# EasyEDA schematic SCH_ThePoweredProject_2023-10-22.json
TITLE: OpenPower; REV: 1.0; Date: 18-08-2023; Sheet: 1/1; Drawn By: Shaurya
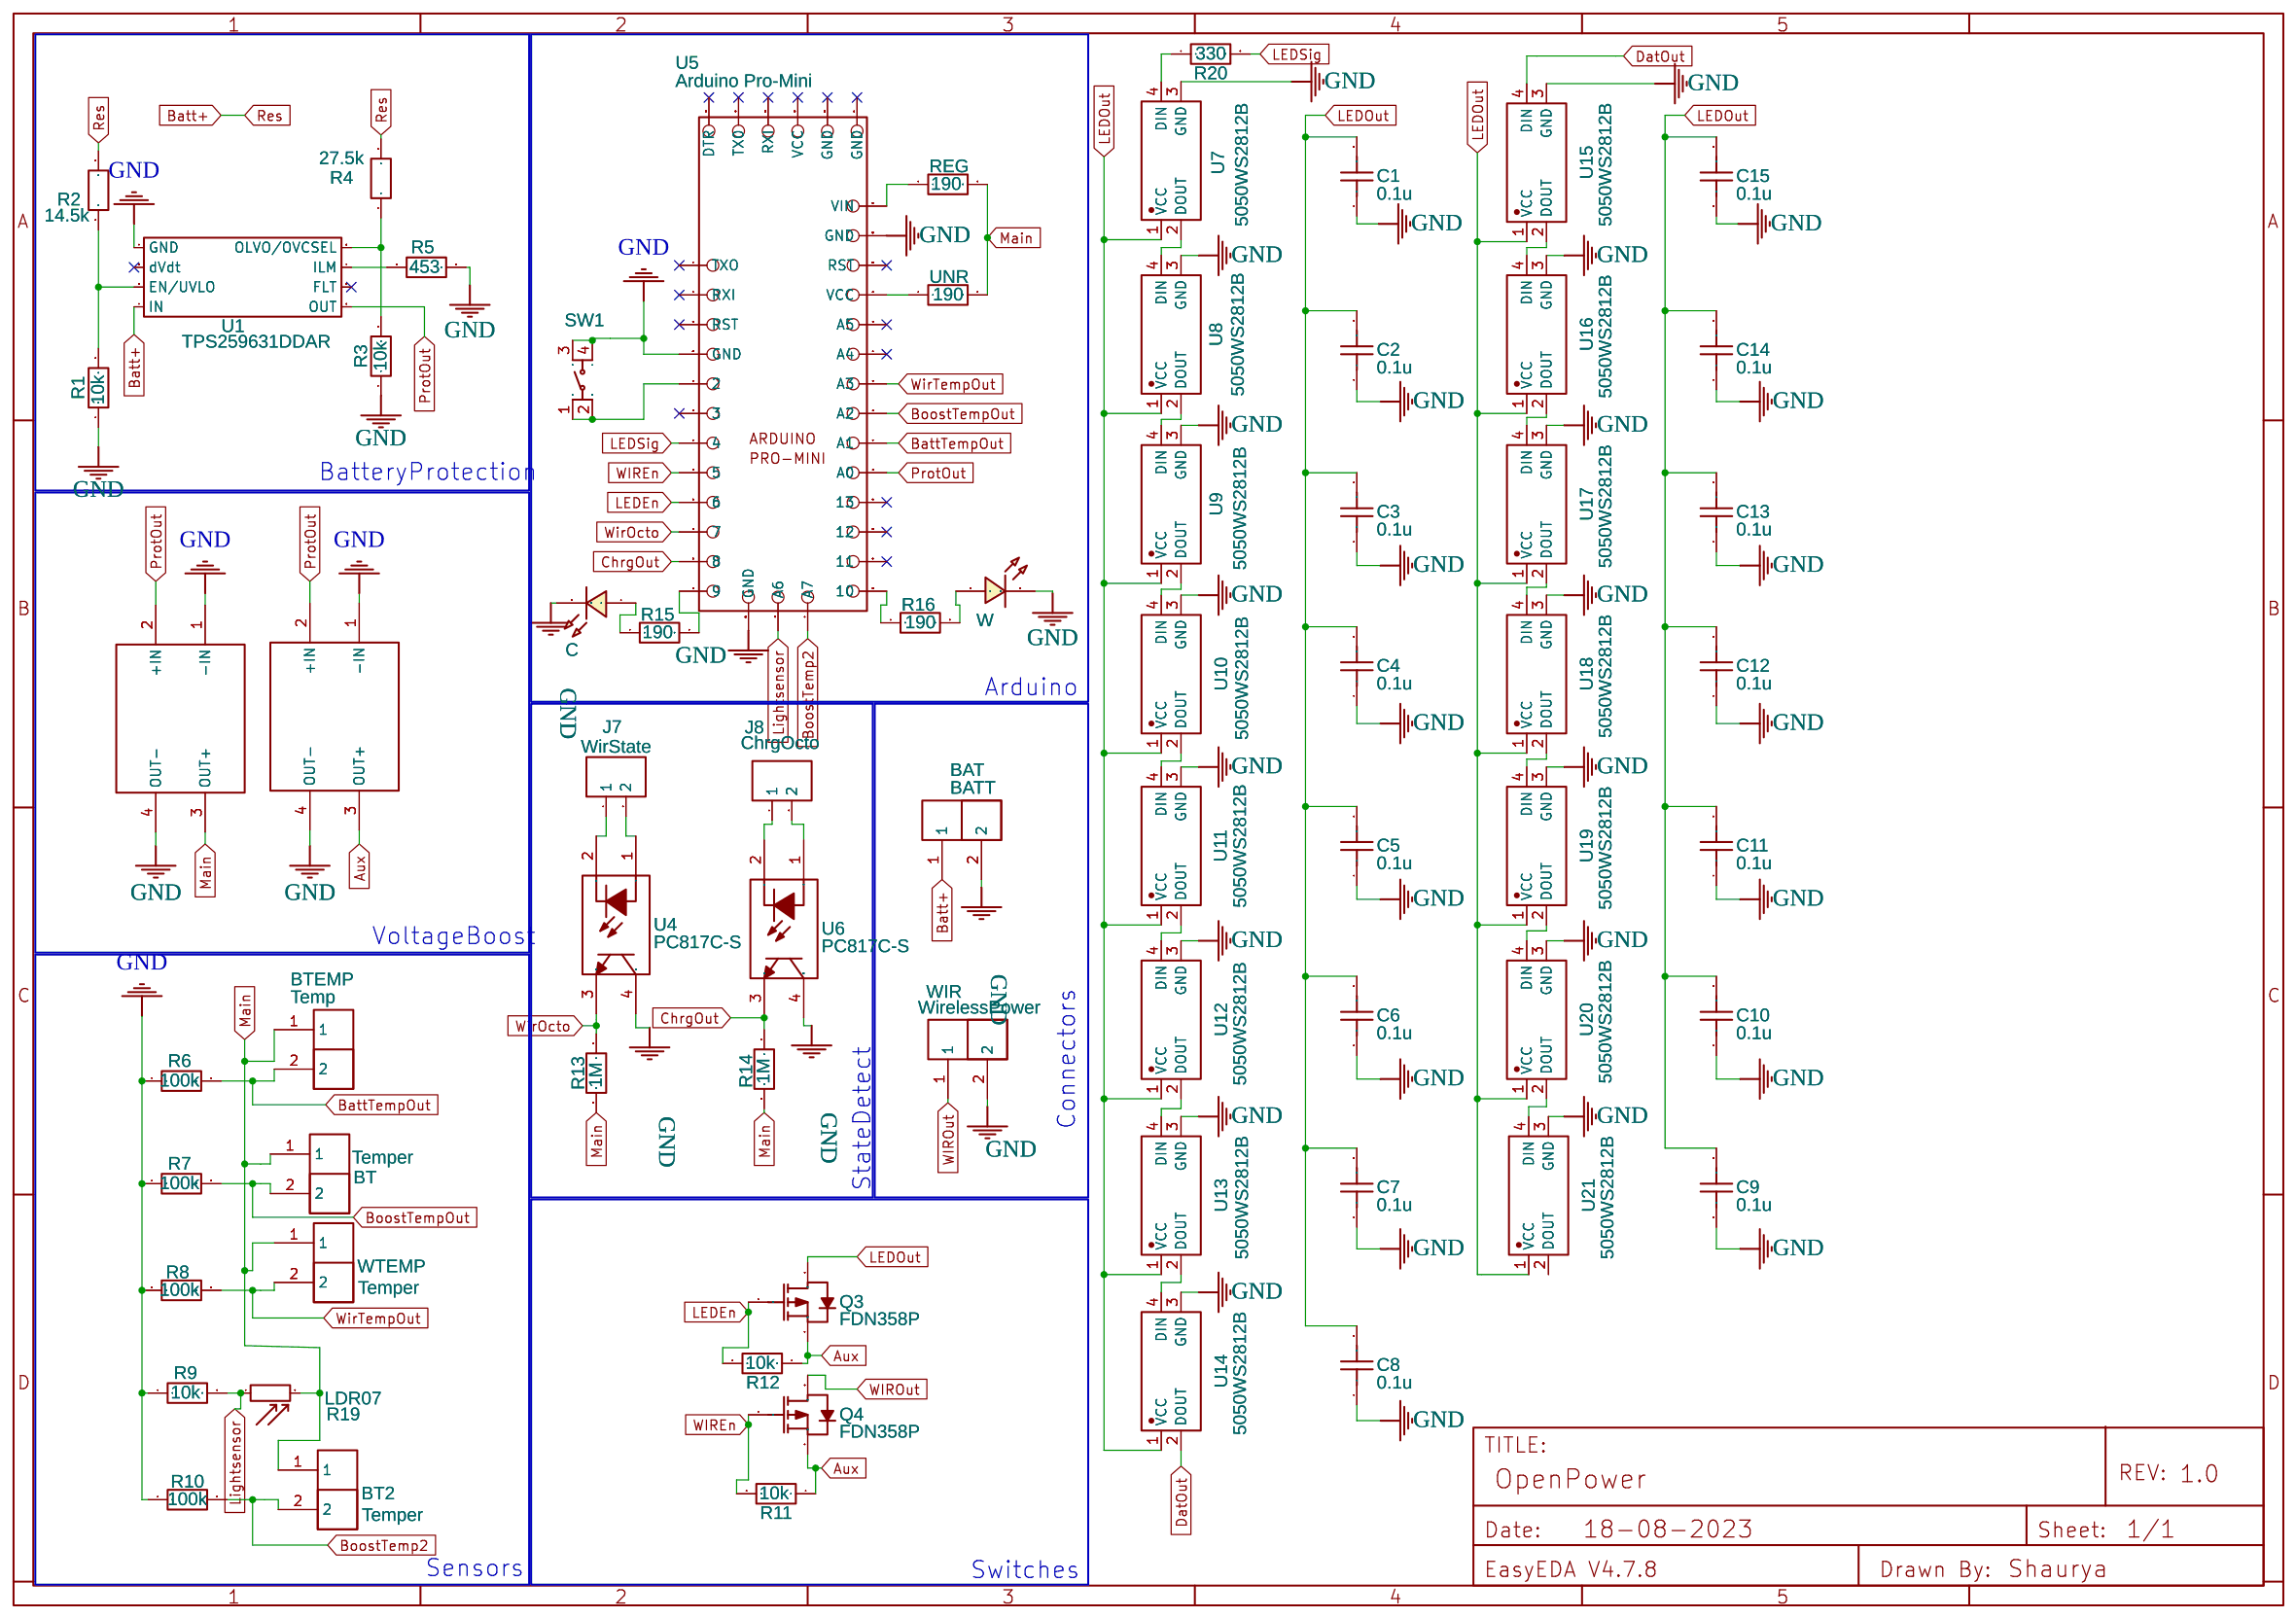
[diagram p0: schematic sheet]

## Parts
BAT  BATT  [SMD_PADS]
BT  Temper  [SMD_PADS]
BT2  Temper  [SMD_PADS]
BTEMP  Temp  [SMD_PADS]
C  LED2  [LED0603_RED]
C1  0.1u  [C0603]
C2  0.1u  [C0603]
C3  0.1u  [C0603]
C4  0.1u  [C0603]
C5  0.1u  [C0603]
C6  0.1u  [C0603]
C7  0.1u  [C0603]
C8  0.1u  [C0603]
C9  0.1u  [C0603]
C10  0.1u  [C0603]
C11  0.1u  [C0603]
C12  0.1u  [C0603]
C13  0.1u  [C0603]
C14  0.1u  [C0603]
C15  0.1u  [C0603]
J7  WirState  [HDR-M-2.54_1X2]
J8  ChrgOcto  [HDR-M-2.54_1X2]
Q3  FDN358P  [SOT-23-3_L2.9-W1.6-P1.90-LS2.8-BR]
Q4  FDN358P  [SOT-23-3_L2.9-W1.6-P1.90-LS2.8-BR]
R1  10k  [R0603]
R2  14.5k  [R0603]
R3  10k  [R0603]
R4  27.5k  [R0603]
R5  453  [R0603]
R6  100k  [R0603]
R7  100k  [R0603]
R8  100k  [R0603]
R9  10k  [R0603]
R10  100k  [R0603]
R11  10k  [R0603]
R12  10k  [R0603]
R13  1M  [R0603]
R14  1M  [R0603]
R15  190  [R0603]
R16  190  [R0603]
R19  LDR07  [RESISTOR_LDR_5.1X4.3_RM3.4]
R20  330  [R0603]
REG  190  [R0603]
SW1  Black SMD switch  [PTS647]
U1  TPS259631DDAR  [TPS259631DDAR]
U2  Mini boost DC-DC converter  [MINI BOOST DC-ВС CONVERTER]
U3  Mini boost DC-DC converter  [MINI BOOST DC-ВС CONVERTER]
U4  PC817C-S  [SOP-4_L6.5-W4.6-P2.54-LS10.3-TL]
U5  Arduino Pro-Mini  [ARDUINOPROMINI_ARDUINO_PRO_MINI]
U6  PC817C-S  [SOP-4_L6.5-W4.6-P2.54-LS10.3-TL]
U7  5050WS2812B  [LED-SMD_5050WS2812B]
U8  5050WS2812B  [LED-SMD_5050WS2812B]
U9  5050WS2812B  [LED-SMD_5050WS2812B]
U10  5050WS2812B  [LED-SMD_5050WS2812B]
U11  5050WS2812B  [LED-SMD_5050WS2812B]
U12  5050WS2812B  [LED-SMD_5050WS2812B]
U13  5050WS2812B  [LED-SMD_5050WS2812B]
U14  5050WS2812B  [LED-SMD_5050WS2812B]
U15  5050WS2812B  [LED-SMD_5050WS2812B]
U16  5050WS2812B  [LED-SMD_5050WS2812B]
U17  5050WS2812B  [LED-SMD_5050WS2812B]
U18  5050WS2812B  [LED-SMD_5050WS2812B]
U19  5050WS2812B  [LED-SMD_5050WS2812B]
U20  5050WS2812B  [LED-SMD_5050WS2812B]
U21  5050WS2812B  [LED-SMD_5050WS2812B]
UNR  190  [R0603]
W  Led1  [LED0603_RED]
WIR  WirelessPower  [SMD_PADS]
WTEMP  Temper  [SMD_PADS]

## Library data of the parts
BAT BT BT2 BTEMP WIR WTEMP = 2 smd pads: Contributor: Shaurya
C W = LED-0603_R: Manufacturer: EVERLIGHT(台湾亿光); Manufacturer Part: 19-217/R6C-AL1M2VY/3T; Supplier Part: C72044; Supplier: LCSC; Contributor: LCEDA_01
C1-C15 = C_0603_US: Contributor: LCEDA_Lib
J7 J8 = HDR-M-2.54_1x2: Supplier Part: C124375; Supplier: LCSC; Contributor: LCEDA_Lib
Q3 Q4 = FDN358P: Supplier: LCSC; Manufacturer: onsemi(安森美); Supplier Part: C24848; JLCPCB Part Class: Extended Part
R1-R16 R20 REG UNR = R_0603_EU: Contributor: LCEDA_Lib
R19 = LDR07: Contributor: KiCAD; license: https://www.gnu.org/licenses/lgpl-2.1.html
SW1 = Black SMD switch: Supplier: Digi-Key; Supplier Part: CKN9084CT-ND; Manufacturer: C&K; Manufacturer Part: PTS 647 SM50 SMTR2 LFS; Contributor: dr.Sybren
U1 = TPS259631DDAR: Contributor: MarvinVoetmann
U2 U3 = Mini boost DC-DC converter: Contributor: fancarver
U4 U6 = PC817C-S: Supplier: LCSC; Supplier Part: C3008369; Manufacturer: UMW(广东友台半导体); link: https://atta.szlcsc.com/upload/public/pdf/source/20220426/D9D4F16FD03F9B6A371B29B6E9F939A1.pdf; Contributor: lcsc; JLCPCB Part Class: Extended Part
U5 = Arduino Pro-Mini: Contributor: Yaroslav Jar
U7-U21 = 5050WS2812B: Contributor: LCSC; Supplier: LCSC; Supplier Part: C2874876; Manufacturer: null; JLCPCB Part Class: Extended Part; link: https://lcsc.com/eda_search?q=C2874876&%26type=1&ref=editor

## Nets
GND: BAT.2 C.2 C1.1 C2.1 C3.1 C4.1 C5.1 C6.1 C7.1 C8.1 C9.1 C10.1 C11.1 C12.1 C13.1 C14.1 C15.1 R1.1 R3.1 R5.1 R6.1 R7.1 R8.1 R9.1 R10.1 SW1.3 SW1.4 U1.1(GND) U2.1(-IN) U2.4(OUT-) U3.1(-IN) U3.4(OUT-) U4.4(COL) U5.GND U5.GND@1(GND) U5.GND@3(GND) U6.4(COL) U7.3(GND) U8.3(GND) U9.3(GND) U10.3(GND) U11.3(GND) U12.3(GND) U13.3(GND) U14.3(GND) U15.3(GND) U16.3(GND) U17.3(GND) U18.3(GND) U19.3(GND) U20.3(GND) U21.3(GND) W.2 WIR.2
Aux: Q3.2(S) Q4.2(S) R11.1 R12.1 U3.3(OUT+)
Batt+: BAT.1 R2.2 R4.2 U1.4(IN)
BattTempOut: BTEMP.2 R6.2 U5.A1
BoostTemp2: BT2.2 R10.2 U5.A7
BoostTempOut: BT.2 R7.2 U5.A2
ChrgOut: R14.1 U5.D8(8) U6.3(EM)
DatOut: U14.2(DOUT) U15.4(DIN)
LEDEn: Q3.1(G) R12.2 U5.D6(6)
LEDOut: C1.2 C2.2 C3.2 C4.2 C5.2 C6.2 C7.2 C8.2 C9.2 C10.2 C11.2 C12.2 C13.2 C14.2 C15.2 Q3.3(D) U7.1(VCC) U8.1(VCC) U9.1(VCC) U10.1(VCC) U11.1(VCC) U12.1(VCC) U13.1(VCC) U14.1(VCC) U15.1(VCC) U16.1(VCC) U17.1(VCC) U18.1(VCC) U19.1(VCC) U20.1(VCC) U21.1(VCC)
LEDSig: R20.2 U5.D4(4)
Lightsensor: R9.2 R19.1 U5.A6
Main: BT.1 BT2.1 BTEMP.1 R13.2 R14.2 R19.2 REG.2 U2.3(OUT+) UNR.2 WTEMP.1
ProtOut: U1.5(OUT) U2.2(+IN) U3.2(+IN) U5.A0
WIREn: Q4.1(G) R11.2 U5.D5(5)
WirOcto: R13.1 U4.3(EM) U5.D7(7)
WIROut: Q4.3(D) WIR.1
WirTempOut: R8.2 U5.A3 WTEMP.2
Net-(C-1): C.1 R15.1
Net-(J7-1): J7.1 U4.2(CAT)
Net-(J7-2): J7.2 U4.1(AN)
Net-(J8-1): J8.1 U6.2(CAT)
Net-(J8-2): J8.2 U6.1(AN)
Net-(R1-2): R1.2 R2.1 U1.3(EN/UVLO)
Net-(R3-2): R3.2 R4.1 U1.8(OLVO/OVCSEL)
Net-(R5-2): R5.2 U1.7(ILM)
Net-(R15-2): R15.2 U5.D9(9)
Net-(R16-1): R16.1 U5.D10(10)
Net-(R16-2): R16.2 W.1
Net-(R20-1): R20.1 U7.4(DIN)
Net-(REG-1): REG.1 U5.RAW(VIN)
Net-(SW1-1): SW1.1 SW1.2 U5.D2(2)
Net-(U5-VCC): U5.VCC UNR.1
Net-(U7-2): U7.2(DOUT) U8.4(DIN)
Net-(U8-2): U8.2(DOUT) U9.4(DIN)
Net-(U9-2): U9.2(DOUT) U10.4(DIN)
Net-(U10-2): U10.2(DOUT) U11.4(DIN)
Net-(U11-2): U11.2(DOUT) U12.4(DIN)
Net-(U12-2): U12.2(DOUT) U13.4(DIN)
Net-(U13-2): U13.2(DOUT) U14.4(DIN)
Net-(U15-2): U15.2(DOUT) U16.4(DIN)
Net-(U16-2): U16.2(DOUT) U17.4(DIN)
Net-(U17-2): U17.2(DOUT) U18.4(DIN)
Net-(U18-2): U18.2(DOUT) U19.4(DIN)
Net-(U19-2): U19.2(DOUT) U20.4(DIN)
Net-(U20-2): U20.2(DOUT) U21.4(DIN)

Not connected (* = marked no-connect by the designer): U1 2(dVdt)* 6(FLT)*; U5 A4* A5* BLK(GND)* D3(3)* D11(11)* D12(12)* D13(13)* DTR* GND@2(GND)* RST* RST@1(RST)* RX(RXI)* RX@1(RXI)* TX(TXO)* TX@1(TX0)* VCC@1(VCC)*; U21 2(DOUT)

## Notes on the sheet
- BatteryProtection
- Arduino
- VoltageBoost
- Connectors
- StateDetect
- Sensors
- Switches
